# Altium schematic sheet graviton.SchDoc: Graviton - Top Sheet
size Legal; CheckedBy: J. Brinton; CompanyName: Signal Laboratories, Inc.; DrawnBy: J. Brinton; Engineer: J. Brinton; Address1: 3479 Edison Way; Address2: Menlo Park CA 94025; Address3: +1 (877) 778-8435; Address4: siglabs.com; DocumentNumber: 1; Revision: 1; SheetNumber: 1; SheetTotal: 58
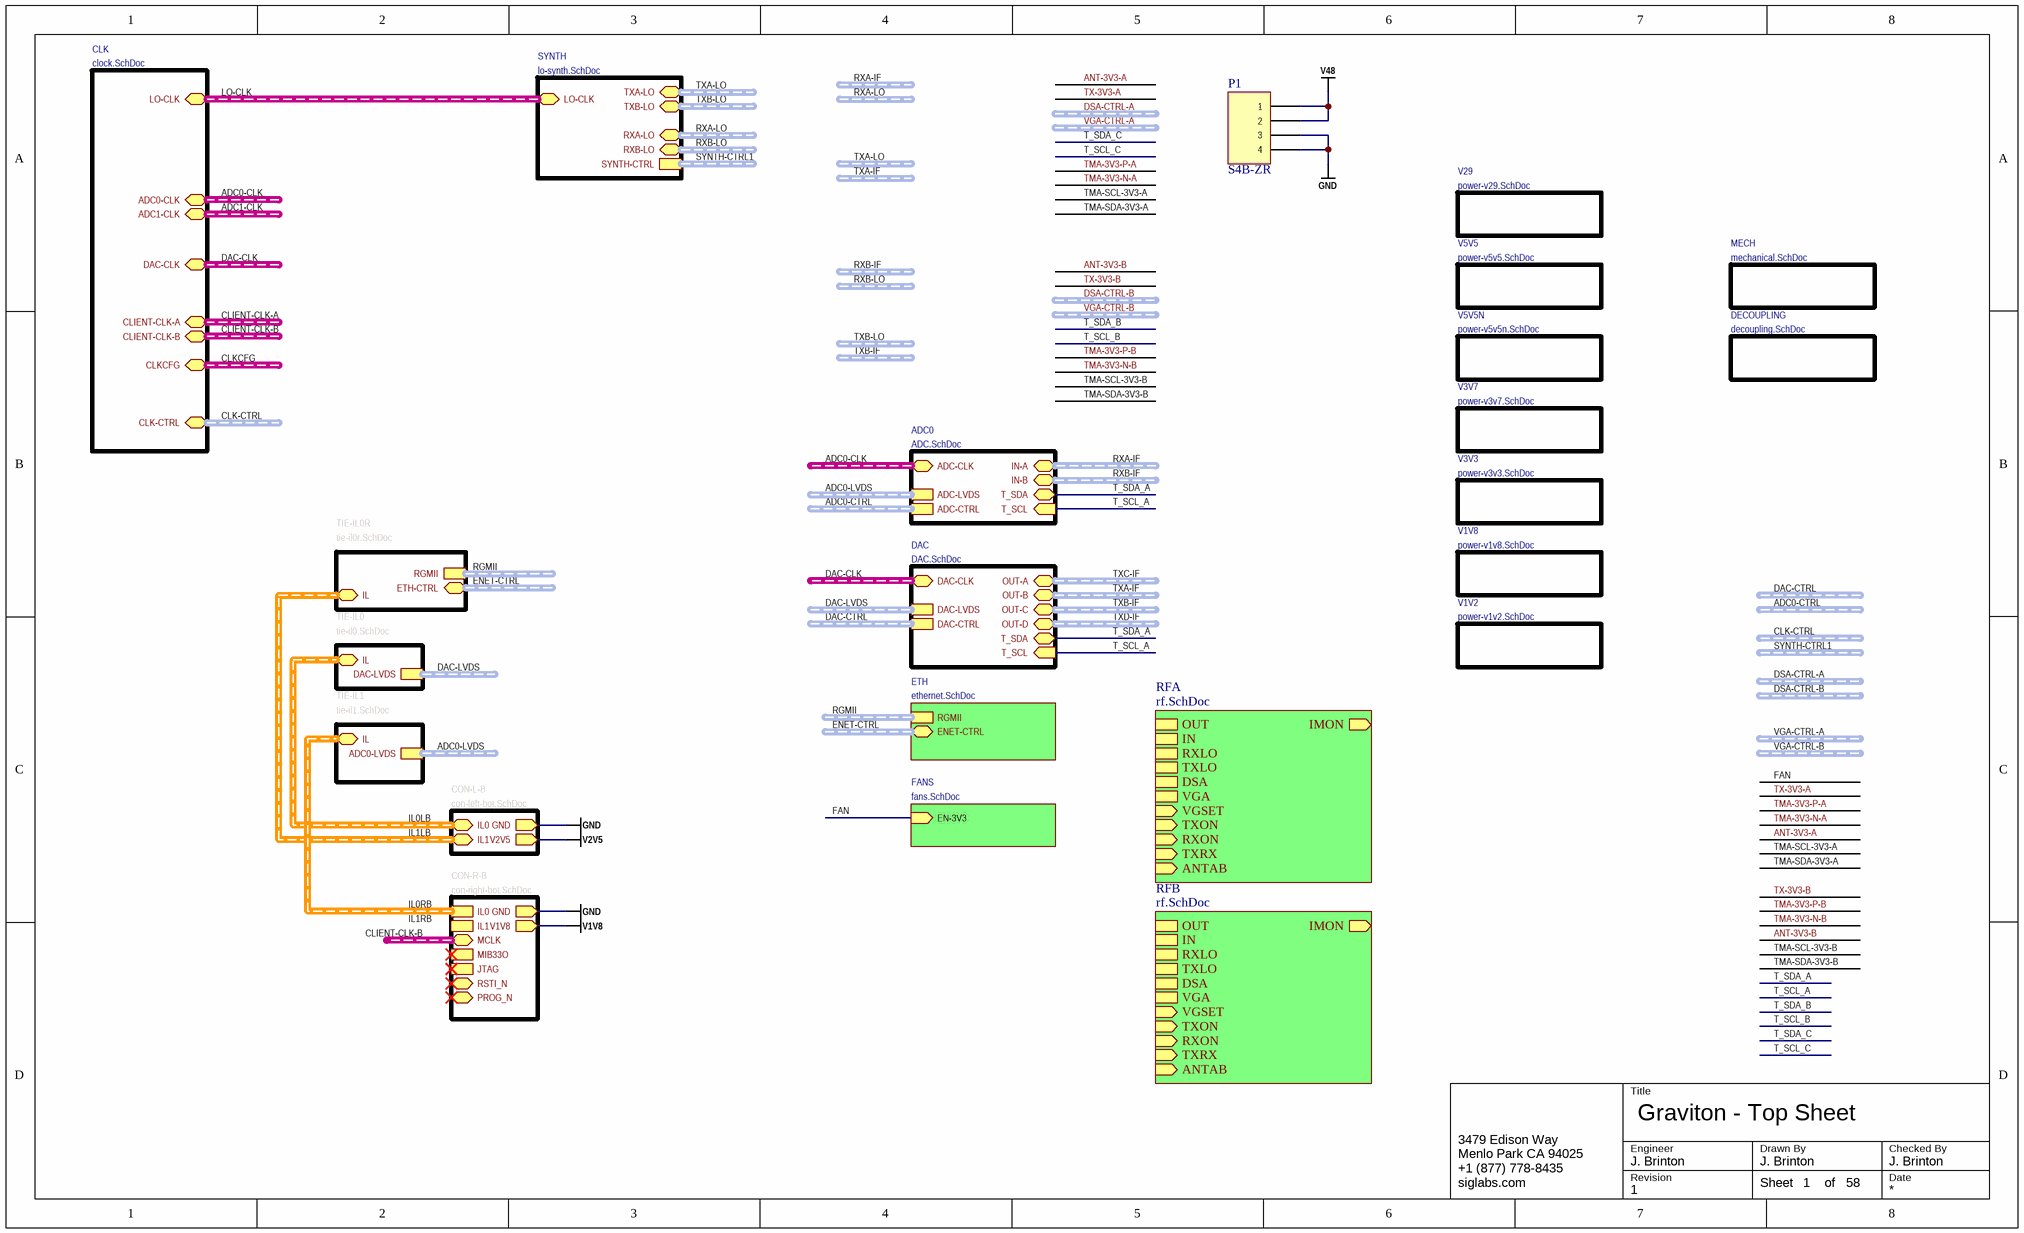
[diagram p0: graviton.SchDoc]

## Parts
P1  S4B-ZR  [S4B-ZR]

## Sub-sheets
ADC0 = ADC.SchDoc: ADC-LVDS (harness ADC-LVDS), ADC-CTRL (harness ADC-CTRL-1V8), ADC-CLK (harness CLK-LVPECL33-TERM), IN-B (harness DIFF100), IN-A (harness DIFF100), T_SCL (in), T_SDA (bidir)
CLK = clock.SchDoc: CLK-CTRL (harness CLK-CTRL), CLIENT-CLK-A (harness CLK-LVPECL33), ADC0-CLK (harness CLK-LVPECL33-TERM), LO-CLK (harness CLK-LVPECL33), DAC-CLK (harness CLK-LVPECL33-TERM), CLIENT-CLK-B (harness CLK-LVPECL33), ADC1-CLK (harness CLK-LVPECL33-TERM), CLKCFG (harness CLK-LVPECL33)
CON-L-B = con-left-bot.SchDoc: IL0 (harness IL), IL1 (harness IL), GND, V2V5
CON-R-B = con-right-bot.SchDoc: IL1 (harness IL), MCLK (harness CLK-LVPECL33), MIB33O (harness MIB), JTAG (harness JTAG-3V3), RSTI_N (bidir), PROG_N (bidir), IL0 (harness IL), GND, V1V8
DAC = DAC.SchDoc: DAC-CTRL (harness DAC-CTRL), DAC-LVDS (harness DAC-LVDS), OUT-A (harness DIFF100), OUT-B (harness DIFF100), OUT-C (harness DIFF100), OUT-D (harness DIFF100), DAC-CLK (harness CLK-LVPECL33-TERM), T_SCL (in), T_SDA (bidir)
DECOUPLING = decoupling.SchDoc: no entries
ETH = ethernet.SchDoc: RGMII (harness RGMII), ENET-CTRL (harness ENET-CTRL)
FANS = fans.SchDoc: EN-3V3 (in)
MECH = mechanical.SchDoc: no entries
RFA = rf.SchDoc: OUT (harness DIFF100), IN (harness DIFF100), RXLO (harness CLK-LVDS), TXLO (harness CLK-LVDS), DSA (harness DSA_CTRL), VGA (harness SPI), IMON (out), VGSET (in), TXON (in), RXON (in), TXRX (in), ANTAB (in)
RFB = rf.SchDoc: OUT (harness DIFF100), IN (harness DIFF100), RXLO (harness CLK-LVDS), TXLO (harness CLK-LVDS), DSA (harness DSA_CTRL), VGA (harness SPI), IMON (out), VGSET (in), TXON (in), RXON (in), TXRX (in), ANTAB (in)
SYNTH = lo-synth.SchDoc: SYNTH-CTRL (harness SYNTH-CTRL), LO-CLK (harness CLK-LVPECL33), TXA-LO (harness CLK-LVPECL33), RXA-LO (harness CLK-LVDS), RXB-LO (harness CLK-LVDS), TXB-LO (harness CLK-LVPECL33)
TIE-IL0 = tie-il0.SchDoc: IL (harness IL), DAC-LVDS (harness DAC-LVDS)
TIE-IL0R = tie-il0r.SchDoc: IL (harness IL), RGMII (harness RGMII), ETH-CTRL (harness ENET-CTRL)
TIE-IL1 = tie-il1.SchDoc: IL (harness IL), ADC0-LVDS (harness ADC-LVDS)
V1V2 = power-v1v2.SchDoc: no entries
V1V8 = power-v1v8.SchDoc: no entries
V3V3 = power-v3v3.SchDoc: no entries
V3V7 = power-v3v7.SchDoc: no entries
V5V5 = power-v5v5.SchDoc: no entries
V5V5N = power-v5v5n.SchDoc: no entries
V29 = power-v29.SchDoc: no entries

## Nets
GND: P1.3 P1.4 ; sheet CON-L-B/GND, sheet CON-R-B/GND
V1V8: sheet CON-R-B/V1V8
V2V5: sheet CON-L-B/V2V5
V48: P1.1 P1.2
FAN: sheet FANS/EN-3V3
T_SCL_A: sheet ADC0/T_SCL, sheet DAC/T_SCL
T_SDA_A: sheet ADC0/T_SDA, sheet DAC/T_SDA

## Buses and harness runs
harness ADC0-CLK = sheet ADC0/ADC-CLK
harness ADC0-CLK = sheet CLK/ADC0-CLK
harness ADC0-CTRL = sheet ADC0/ADC-CTRL
harness ADC0-LVDS = sheet ADC0/ADC-LVDS
harness ADC0-LVDS = sheet TIE-IL1/ADC0-LVDS
harness ADC1-CLK = sheet CLK/ADC1-CLK
harness CLIENT-CLK-A = sheet CLK/CLIENT-CLK-A
harness CLIENT-CLK-B = sheet CLK/CLIENT-CLK-B
harness CLK-CTRL = sheet CLK/CLK-CTRL
harness CLKCFG = sheet CLK/CLKCFG
harness DAC-CLK = sheet CLK/DAC-CLK
harness DAC-CLK = sheet DAC/DAC-CLK
harness DAC-CTRL = sheet DAC/DAC-CTRL
harness DAC-LVDS = sheet DAC/DAC-LVDS
harness DAC-LVDS = sheet TIE-IL0/DAC-LVDS
harness ENET-CTRL = sheet ETH/ENET-CTRL
harness ENET-CTRL = sheet TIE-IL0R/ETH-CTRL
harness IL0LB = sheet CON-L-B/IL0 = sheet TIE-IL0/IL
harness IL0RB = sheet CON-R-B/IL0 = sheet TIE-IL1/IL
harness IL1LB = sheet CON-L-B/IL1 = sheet TIE-IL0R/IL
harness LO-CLK = sheet CLK/LO-CLK = sheet SYNTH/LO-CLK
harness RGMII = sheet ETH/RGMII
harness RGMII = sheet TIE-IL0R/RGMII
harness RXA-IF = sheet ADC0/IN-A
harness RXA-LO = sheet SYNTH/RXA-LO
harness RXB-IF = sheet ADC0/IN-B
harness RXB-LO = sheet SYNTH/RXB-LO
harness SYNTH-CTRL1 = sheet SYNTH/SYNTH-CTRL
harness TXA-IF = sheet DAC/OUT-B
harness TXA-LO = sheet SYNTH/TXA-LO
harness TXB-IF = sheet DAC/OUT-C
harness TXB-LO = sheet SYNTH/TXB-LO
harness TXC-IF = sheet DAC/OUT-A
harness TXD-IF = sheet DAC/OUT-D

## Notes on the sheet
- Labels drawn without touching a wire or pin: CLIENT-CLK-B, IL1RB
- Title
- Engineer
- Revision
- Drawn By
- Checked By
- Date
- Sheet
- of

## Library data of the parts
P1 = S4B-ZR: 1.5mm pitch right angle 6-position; Manufacturer: JST; Manufacturer P/N: S4B-ZR